# Altium project Manchester-Comparator_Module.PrjPcb
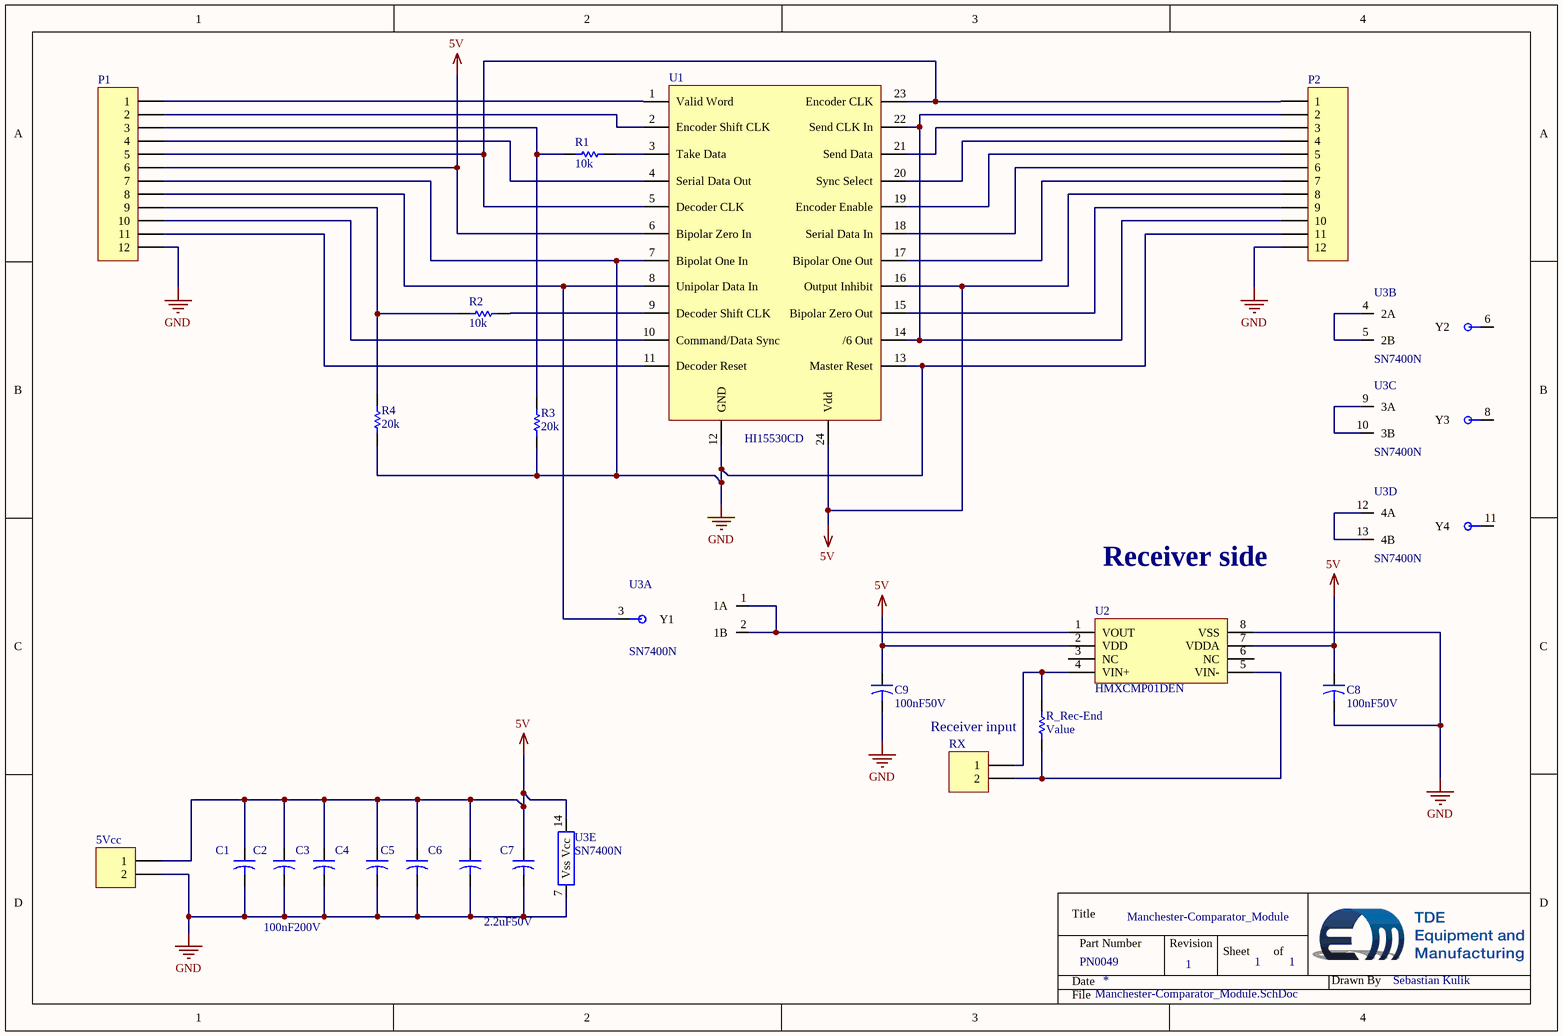
[diagram p0: Manchester-Comparator_Module.SchDoc]
1 sheet, 23 parts. Net scope: global (net labels, ports and power ports of the same name join across sheets).
Board file: Manchester-Comparator_Module.PcbDoc

## Sheet Manchester-Comparator_Module.SchDoc: Manchester-Comparator_Module
size A4; Revision: 1; SheetNumber: 1; SheetTotal: 1; PartNumber: PN0049; Drawn By: Sebastian Kulik

### Parts
5Vcc  PHOENIX_1715721  [Phoenix-2-5_08]  (value not drawn)
*  Eye  [Eye]  (value not drawn)
**  Eye  [Eye]  (value not drawn)
C1  Capacitor-Dummy-THT  [Dummy-10mm]  (value not drawn)
C2  Capacitor-Dummy-THT  [Dummy-10mm]  (value not drawn)
C3  value 100nF200V  [Dummy-10mm]  (hidden comment: Capacitor-Dummy-THT)
C4  Capacitor-Dummy-THT  [Dummy-10mm]  (value not drawn)
C5  Capacitor-Dummy-THT  [Dummy-10mm]  (value not drawn)
C6  Capacitor-Dummy-THT  [Dummy-10mm]  (value not drawn)
C7  value 2.2uF50V  [Dummy-10mm]  (hidden comment: Capacitor-Dummy-THT)
C8  value 100nF50V  [KEMET-C052H]  (hidden comment: 100nF_50V_THT_HT)
C9  value 100nF50V  [KEMET-C052H]  (hidden comment: 100nF_50V_THT_HT)
P1  Plug_12_2.54  [HDR1X12_2.54]  (value not drawn)
P2  Plug_12_2.54  [HDR1X12_2.54]  (value not drawn)
R1  value 10k  [Dummy-10mm]  (hidden comment: 10k_10mm-HT)
R2  value 10k  [Dummy-10mm]  (hidden comment: 10k_10mm-HT)
R3  value 20k  [Dummy-10mm]  (hidden comment: 20k_10mm-HT)
R4  value 20k  [Dummy-10mm]  (hidden comment: 20k_10mm-HT)
R_Rec-End  Resistor-Dummy-THT  [Dummy-10mm]  (value not drawn)
RX  PHOENIX_1715721  [Phoenix-2-5_08]  (value not drawn)
U1  HI15530CD  [DIP-24-Ceramic-HT]
U2  HMXCMP01DEN  [Honeywell-SO8]
U3  SN7400N  [DIP-14]  (parts A,B,C,D,E of 5)

### Nets
5V: 5Vcc.1 C1.1 C2.1 C3.1 C4.1 C5.1 C6.1 C7.1 C8.1 C9.1 P1.6 P2.8 U1.6(Bipolar_Zero_In) U1.16(Output_Inhibit) U1.24(Vdd) U2.2(VDD) U2.7(VDDA) U3.14(Vcc)
GND: 5Vcc.2 C1.2 C2.2 C3.2 C4.2 C5.2 C6.2 C7.2 C8.2 C9.2 P1.7 P1.12 P2.11 P2.12 R3.1 R4.1 U1.7(Bipolat_One_In) U1.12(GND) U1.13(Master_Reset) U2.8(VSS) U3.7(Vss)
NetP1_1: P1.1 U1.1(Valid_Word)
NetP1_2: P1.2 U1.2(Encoder_Shift_CLK)
NetP1_3: P1.3 R1.2 R3.2
NetP1_4: P1.4 U1.4(Serial_Data_Out)
NetP1_5: P1.5 P2.1 U1.5(Decoder_CLK) U1.23(Encoder_CLK)
NetP1_8: P1.8 U1.8(Unipolar_Data_In) U3.3(Y1)
NetP1_9: P1.9 R2.2 R4.2
NetP1_10: P1.10 U1.10(Command/Data_Sync)
NetP1_11: P1.11 U1.11(Decoder_Reset)
NetP2_2: P2.2 P2.10 U1.14(/6_Out) U1.22(Send_CLK_In)
NetP2_3: P2.3 U1.21(Send_Data)
NetP2_4: P2.4 U1.20(Sync_Select)
NetP2_5: P2.5 U1.19(Encoder_Enable)
NetP2_6: P2.6 U1.18(Serial_Data_In)
NetP2_7: P2.7 U1.17(Bipolar_One_Out)
NetP2_9: P2.9 U1.15(Bipolar_Zero_Out)
NetR1_1: R1.1 U1.3(Take_Data)
NetR2_1: R2.1 U1.9(Decoder_Shift_CLK)
NetR_Rec-End_1: R_Rec-End.1 RX.2 U2.5(VIN-)
NetR_Rec-End_2: R_Rec-End.2 RX.1 U2.4(VIN+)
NetU2_1: U2.1(VOUT) U3.1(1A) U3.2(1B)
NetU3_4: U3.4(2A) U3.5(2B)
NetU3_9: U3.9(3A) U3.10(3B)
NetU3_12: U3.12(4A) U3.13(4B)

Not connected (* = marked no-connect by the designer): U2 3(NC) 6(NC); U3 6(Y2) 8(Y3) 11(Y4)

### Notes on the sheet
- Receiver side
- (near R_Rec-End) Receiver input
- Title
- Date
- Part Number
- Revision
- Sheet
- of
- Drawn By
- File

### Library data of the parts
5Vcc RX = 2Pol_1715721: Phoenix, 2 pol, 5.08mm, 22A, 715721; Deliverer PartNr: 193-0564; Deliverer: RS; TDE-PN: CON0008; LatestRevisionDate: 02.05.2014; LatestRevisionNote: Re-released for DXP Platform.; Publisher: Sebastian Kulik; Manufacturer PartNr: 1715721; Manufacturer: Phoenix; PackageDescription: Phoenix-2-5_08
  5Vcc: Price: 0.976/5
C1 C2 = Capacitor-Dummy-THT: Deliverer PartNr: 2544877; Deliverer: Farnell; Value: 100nF200V; Published: 08.12.2015; Part Description: Capacitor-Dummy-THT; Publisher: Sebastian Kulik; PackageDescription: -; Manufacturer: -; Manufacturer PartNr: -; TDE-PN: -; Price: 0.51/10
C3 = Capacitor-Dummy-THT: Deliverer PartNr: 2544877; Deliverer: Farnell; Published: 08.12.2015; Part Description: Capacitor-Dummy-THT; Publisher: Sebastian Kulik; PackageDescription: -; Manufacturer: -; Manufacturer PartNr: -; TDE-PN: -; Price: 0.51/10
C4-C6 = Capacitor-Dummy-THT: Deliverer PartNr: 2529490; Deliverer: Farnell; Value: 2.2uF50V; Published: 08.12.2015; Part Description: Capacitor-Dummy-THT; Publisher: Sebastian Kulik; PackageDescription: -; Manufacturer: -; Manufacturer PartNr: -; TDE-PN: -; Price: 1.28/1
C7 = Capacitor-Dummy-THT: Deliverer PartNr: 2529490; Deliverer: Farnell; Published: 08.12.2015; Part Description: Capacitor-Dummy-THT; Publisher: Sebastian Kulik; PackageDescription: -; Manufacturer: -; Manufacturer PartNr: -; TDE-PN: -; Price: 1.28/1
C8 C9 = 100nF_50V_THT_HT: High Temp C series, NP0, 10%, 50V; Deliverer PartNr: 2452193; Manufacturer: Kemet; Manufacturer PartNr: C052H104K5G5GA; Deliverer: Farnell; TDE-PN: C0073; Published: 18.07.2016; Part Description: High Temp C series, NP0, 10%, 50V; Publisher: Sebastian Kulik; PackageDescription: KEMET, C052H/C062 Series, THT; Price: 10.64/1
P1 P2 = Plug_12_2.54: Plug, 11-Pin; Manufacturer PartNr: 61301211121; Manufacturer: WE; TDE-PN: CON0018; LatestRevisionDate: 27.05.2014; LatestRevisionNote: Re-released for DXP Platform.; Publisher: Sebastian Kulik; Deliverer: WE; Deliverer PartNr: 61301211121
R1 R2 = 10k_10mm-HT: RN60 Series, 1%, 175°C; Manufacturer: Vishay; Manufacturer PartNr: RN60C1002FB14; Deliverer PartNr: 830-7450; TDE-PN: R0083; Deliverer: RS; Published: 18.07.2016; Publisher: Sebastian Kulik; PackageDescription: -; Part Desicription: RN60 Series, 1%, 175°C; Price: 0.15/1
R3 R4 = 20k_10mm-HT: RN60 Series, 1%, 175°C; Manufacturer: Vishay; Manufacturer PartNr: RN60D2002FB14; Deliverer PartNr: 849-9095; TDE-PN: R0082; Deliverer: RS; Published: 18.07.2016; Publisher: Sebastian Kulik; PackageDescription: -; Part Desicription: RN60 Series, 1%, 175°C; Price: 0.12/1
U1 = HI15530CD: Manchester Encoder / Decoder; Deliverer PartNr: HI-15530CD; Manufacturer: HolTEc; Deliverer: ProTec; TDE-PN: IC0078; Published: 18.07.2016; PackageDescription: DIP24; Publisher: Sebastian Kulik; Manufacturer PartNr: HI-15530CD; Price: 131.25/1
U2 = HMXCMP01DEN: HiTemp Comparator; Manufacturer: X-Rel; Deliverer: ProTec; TDE-PN: IC0069; Published: 10.12.2015; Deliverer PartNr: HMXCMP01DEN; PackageDescription: Honeywell-SO8; Publisher: Sebastian Kulik; Manufacturer PartNr: HMXCMP01DEN
U3 = SN7400N: Quad NAND, TTL; Deliverer PartNr: 305-490; Manufacturer: TI; Deliverer: RS; TDE-PN: IC0076; Published: 13.05.2016; PackageDescription: SOIC28; Publisher: Sebastian Kulik; Manufacturer PartNr: SN7400N; Price: 1.45
R_Rec-End = Resistor-Dummy-THT: Published: 08.12.2015; Publisher: Sebastian Kulik; PackageDescription: -; Manufacturer: -; Manufacturer PartNr: -; TDE-PN: -; Deliverer PartNr: -; Deliverer: -; Part Desicription: Resistor-Dummy-THT; Value: Value